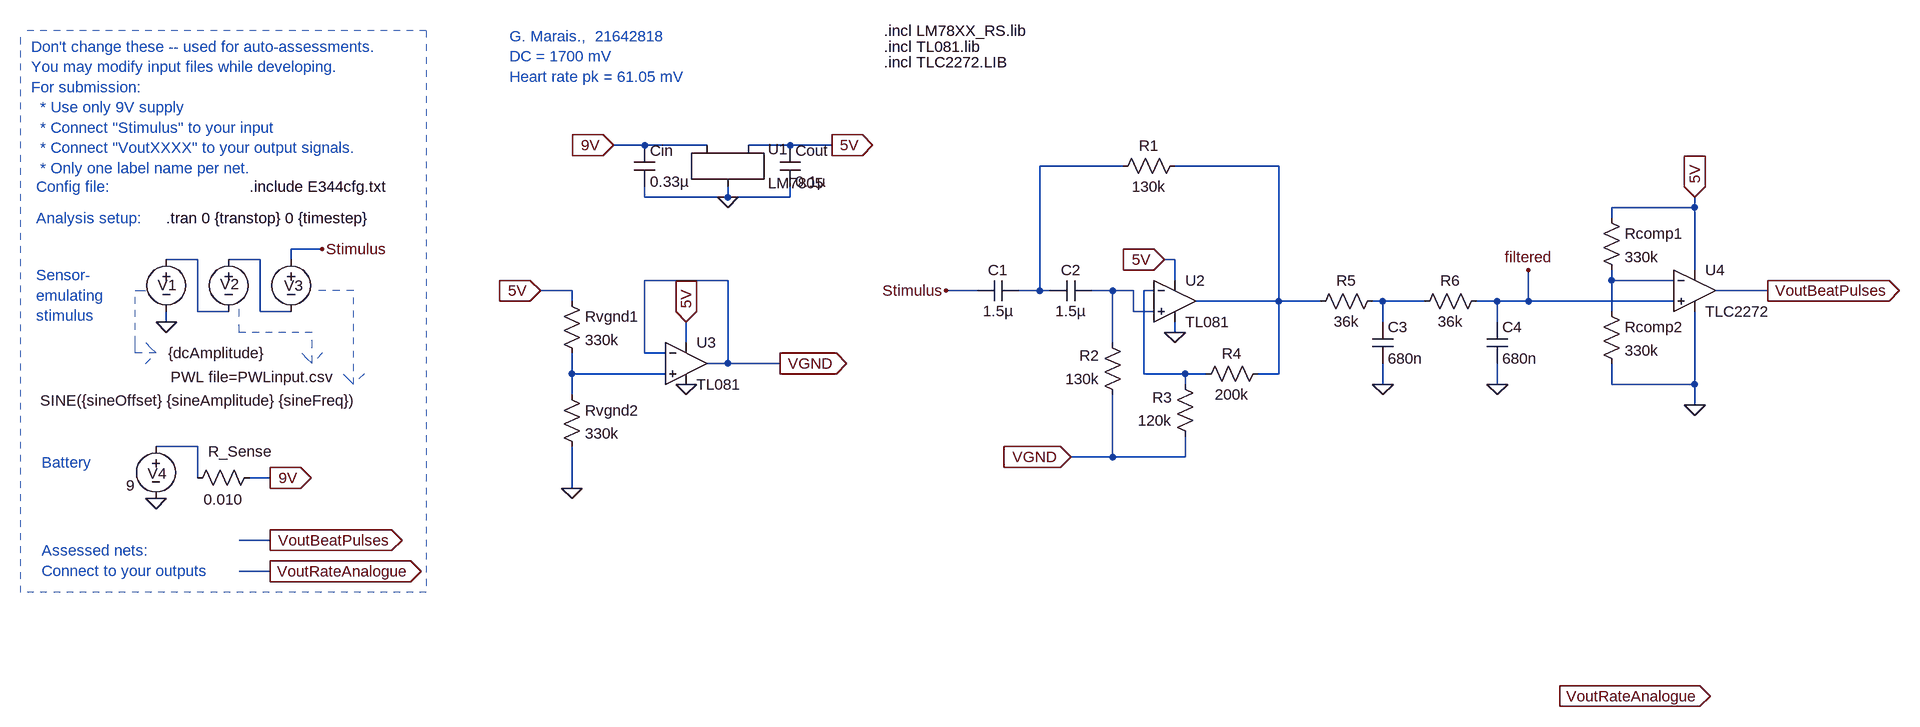
[diagram p0: schematic E344Ass2.asc]
E344Ass2.asc, the LTspice schematic file:
Version 4
SHEET 1 2080 680
WIRE -1344 -1232 -1392 -1232
WIRE -1248 -1232 -1344 -1232
WIRE -1120 -1232 -1184 -1232
WIRE -1056 -1232 -1120 -1232
WIRE -608 -1200 -736 -1200
WIRE -368 -1200 -528 -1200
WIRE -1344 -1152 -1344 -1168
WIRE -1216 -1152 -1216 -1168
WIRE -1216 -1152 -1344 -1152
WIRE -1120 -1152 -1120 -1168
WIRE -1120 -1152 -1216 -1152
WIRE 272 -1136 272 -1152
WIRE 272 -1136 144 -1136
WIRE 144 -1120 144 -1136
WIRE -1840 -1072 -1888 -1072
WIRE -2032 -1056 -2080 -1056
WIRE -1936 -1056 -1984 -1056
WIRE -1888 -1056 -1888 -1072
WIRE -528 -1056 -544 -1056
WIRE 272 -1040 272 -1136
WIRE -1216 -1024 -1344 -1024
WIRE -528 -1024 -528 -1056
WIRE 144 -1024 144 -1040
WIRE 240 -1024 144 -1024
WIRE -1456 -1008 -1504 -1008
WIRE -832 -1008 -880 -1008
WIRE -736 -1008 -736 -1200
WIRE -736 -1008 -768 -1008
WIRE -720 -1008 -736 -1008
WIRE -624 -1008 -656 -1008
WIRE -592 -1008 -624 -1008
WIRE -560 -1008 -576 -1008
WIRE 384 -1008 304 -1008
WIRE -1456 -992 -1456 -1008
WIRE -368 -992 -368 -1200
WIRE -368 -992 -496 -992
WIRE -304 -992 -368 -992
WIRE -208 -992 -224 -992
WIRE -144 -992 -208 -992
WIRE -32 -992 -64 -992
WIRE 16 -992 16 -1040
WIRE 16 -992 -32 -992
WIRE 240 -992 16 -992
WIRE -2032 -976 -2032 -1056
WIRE -1984 -976 -2032 -976
WIRE -1936 -976 -1936 -1056
WIRE -1888 -976 -1936 -976
WIRE -592 -976 -592 -1008
WIRE -560 -976 -592 -976
WIRE 144 -976 144 -1024
WIRE -2080 -960 -2080 -976
WIRE -208 -960 -208 -992
WIRE -32 -960 -32 -992
WIRE -528 -944 -528 -960
WIRE -1280 -928 -1280 -960
WIRE -624 -928 -624 -1008
WIRE -1344 -912 -1344 -1024
WIRE -1312 -912 -1344 -912
WIRE -1216 -896 -1216 -1024
WIRE -1216 -896 -1248 -896
WIRE -1136 -896 -1216 -896
WIRE -1456 -880 -1456 -912
WIRE -1312 -880 -1456 -880
WIRE -576 -880 -576 -1008
WIRE -512 -880 -576 -880
WIRE -480 -880 -512 -880
WIRE -368 -880 -368 -992
WIRE -368 -880 -400 -880
WIRE -512 -864 -512 -880
WIRE -208 -864 -208 -896
WIRE -32 -864 -32 -896
WIRE 144 -864 144 -896
WIRE 272 -864 272 -976
WIRE 272 -864 144 -864
WIRE -1456 -848 -1456 -880
WIRE 272 -832 272 -864
WIRE -2032 -768 -2096 -768
WIRE -624 -752 -624 -848
WIRE -624 -752 -688 -752
WIRE -512 -752 -512 -784
WIRE -512 -752 -624 -752
WIRE -2032 -720 -2032 -768
WIRE -1920 -720 -1952 -720
WIRE -1456 -704 -1456 -768
WIRE -1920 -624 -1968 -624
WIRE -1920 -576 -1968 -576
FLAG -2080 -960 0
FLAG -1840 -1072 Stimulus
FLAG -1920 -720 9V
IOPIN -1920 -720 Out
FLAG -2096 -688 0
FLAG -1392 -1232 9V
IOPIN -1392 -1232 In
FLAG -1920 -624 VoutBeatPulses
IOPIN -1920 -624 Out
FLAG -1920 -576 VoutRateAnalogue
IOPIN -1920 -576 Out
FLAG -1216 -1152 0
FLAG -1056 -1232 5V
IOPIN -1056 -1232 Out
FLAG -1136 -896 VGND
IOPIN -1136 -896 Out
FLAG -1456 -704 0
FLAG -1504 -1008 5V
IOPIN -1504 -1008 In
FLAG -528 -944 0
FLAG -544 -1056 5V
IOPIN -544 -1056 In
FLAG -688 -752 VGND
IOPIN -688 -752 In
FLAG -1280 -864 0
FLAG -1280 -960 5V
IOPIN -1280 -960 In
FLAG 272 -1152 5V
IOPIN 272 -1152 In
FLAG 272 -832 0
FLAG -32 -864 0
FLAG -208 -864 0
FLAG 384 -1008 VoutBeatPulses
IOPIN 384 -1008 Out
FLAG -880 -1008 Stimulus
FLAG 64 -384 VoutRateAnalogue
IOPIN 64 -384 Out
FLAG 16 -1040 filtered
SYMBOL voltage -1984 -1072 R0
WINDOW 123 0 0 Left 0
WINDOW 39 0 0 Left 0
WINDOW 3 -89 197 Left 2
WINDOW 0 -13 54 Left 2
SYMATTR Value PWL file=PWLinput.csv
SYMATTR InstName V2
SYMBOL voltage -1888 -1072 R0
WINDOW 123 24 44 Left 2
WINDOW 39 0 0 Left 0
WINDOW 3 -386 233 Left 2
WINDOW 0 -11 56 Left 2
SYMATTR Value SINE({sineOffset} {sineAmplitude} {sineFreq})
SYMATTR InstName V3
SYMBOL voltage -2080 -1072 R0
WINDOW 123 0 0 Left 0
WINDOW 39 0 0 Left 0
WINDOW 3 3 160 Left 2
WINDOW 0 -13 55 Left 2
SYMATTR Value {dcAmplitude}
SYMATTR InstName V1
SYMBOL voltage -2096 -784 R0
WINDOW 123 24 44 Left 2
WINDOW 39 0 0 Left 0
WINDOW 3 -46 76 Left 2
WINDOW 0 -13 57 Left 2
SYMATTR Value 9
SYMATTR InstName V4
SYMBOL res -1936 -736 R90
WINDOW 0 -9 30 VBottom 2
WINDOW 3 34 56 VTop 2
SYMATTR InstName R_Sense
SYMATTR Value 0.010
SYMBOL LM7805 -1216 -1216 R0
SYMATTR InstName U1
SYMBOL cap -1360 -1232 R0
SYMATTR InstName Cin
SYMATTR Value 0.33µ
SYMBOL cap -1136 -1232 R0
SYMATTR InstName Cout
SYMATTR Value 0.1µ
SYMBOL res -1472 -1008 R0
SYMATTR InstName Rvgnd1
SYMATTR Value 330k
SYMBOL res -1472 -864 R0
SYMATTR InstName Rvgnd2
SYMATTR Value 330k
SYMBOL cap -768 -1024 R90
WINDOW 0 0 32 VBottom 2
WINDOW 3 32 32 VTop 2
SYMATTR InstName C1
SYMATTR Value 1.5µ
SYMBOL cap -656 -1024 R90
WINDOW 0 0 32 VBottom 2
WINDOW 3 32 32 VTop 2
SYMATTR InstName C2
SYMATTR Value 1.5µ
SYMBOL res -512 -1216 R90
WINDOW 0 0 56 VBottom 2
WINDOW 3 32 56 VTop 2
SYMATTR InstName R1
SYMATTR Value 130k
SYMBOL res -608 -832 R180
WINDOW 0 36 76 Left 2
WINDOW 3 36 40 Left 2
SYMATTR InstName R2
SYMATTR Value 130k
SYMBOL res -496 -768 R180
WINDOW 0 36 76 Left 2
WINDOW 3 36 40 Left 2
SYMATTR InstName R3
SYMATTR Value 120k
SYMBOL res -384 -896 R90
WINDOW 0 0 56 VBottom 2
WINDOW 3 32 56 VTop 2
SYMATTR InstName R4
SYMATTR Value 200k
SYMBOL Opamps\\opamp2 -528 -1056 R0
SYMATTR InstName U2
SYMATTR Value TL081
SYMBOL Opamps\\opamp2 -1280 -960 R0
SYMATTR InstName U3
SYMATTR Value TL081
SYMBOL res -208 -1008 R90
WINDOW 0 0 56 VBottom 2
WINDOW 3 32 56 VTop 2
SYMATTR InstName R5
SYMATTR Value 36k
SYMBOL cap -224 -960 R0
SYMATTR InstName C3
SYMATTR Value 680n
SYMBOL Opamps\\opamp2 272 -1072 R0
SYMATTR InstName U4
SYMATTR Value TLC2272
SYMBOL cap -48 -960 R0
SYMATTR InstName C4
SYMATTR Value 680n
SYMBOL res -48 -1008 R90
WINDOW 0 0 56 VBottom 2
WINDOW 3 32 56 VTop 2
SYMATTR InstName R6
SYMATTR Value 36k
SYMBOL res 128 -1136 R0
SYMATTR InstName Rcomp1
SYMATTR Value 330k
SYMBOL res 128 -992 R0
SYMATTR InstName Rcomp2
SYMATTR Value 330k
TEXT -2080 -1120 Left 2 !.tran 0 {transtop} 0 {timestep}
TEXT -1952 -1168 Left 2 !.include E344cfg.txt
TEXT -2288 -1384 Left 2 ;Don't change these -- used for auto-assessments.\nYou may modify input files while developing.\nFor submission: \n  * Use only 9V supply \n  * Connect "Stimulus" to your input\n  * Connect "VoutXXXX" to your output signals.\n  * Only one label name per net.
TEXT -2280 -1168 Left 2 ;Config file:
TEXT -2280 -1120 Left 2 ;Analysis setup:
TEXT -2272 -744 Left 2 ;Battery
TEXT -2280 -1032 Left 2 ;Sensor-\nemulating \nstimulus
TEXT -2272 -608 Left 2 ;Assessed nets:\nConnect to your outputs
TEXT -1552 -1400 Left 2 ;G. Marais.,  21642818\nDC = 1700 mV\nHeart rate pk = 61.05 mV
TEXT -976 -1408 Left 2 !.incl LM78XX_RS.lib
TEXT -976 -1384 Left 2 !.incl TL081.lib
TEXT -976 -1360 Left 2 !.incl TLC2272.LIB
LINE Normal -1792 -1008 -1856 -1008 2
LINE Normal -1792 -864 -1792 -1008 2
LINE Normal -1808 -880 -1792 -864 2
LINE Normal -1792 -864 -1808 -880 2
LINE Normal -1776 -880 -1792 -864 2
LINE Normal -2128 -1008 -2112 -1008 2
LINE Normal -2128 -928 -2128 -1008 2
LINE Normal -2128 -912 -2128 -928 2
LINE Normal -2096 -912 -2128 -912 2
LINE Normal -2112 -928 -2096 -912 2
LINE Normal -2096 -912 -2112 -928 2
LINE Normal -2112 -896 -2096 -912 2
LINE Normal -1968 -944 -1968 -992 2
LINE Normal -1856 -944 -1968 -944 2
LINE Normal -1856 -896 -1856 -944 2
LINE Normal -1872 -912 -1856 -896 2
LINE Normal -1856 -896 -1872 -912 2
LINE Normal -1840 -912 -1856 -896 2
LINE Normal -2304 -544 -2304 -1408 1
LINE Normal -1680 -1408 -1680 -544 1
LINE Normal -1680 -544 -2304 -544 1
LINE Normal -1680 -1408 -2304 -1408 1

The netlist it stands for:
* E344Ass2.asc
V2 N004 N003 PWL file=PWLinput.csv
V3 Stimulus N004 SINE({sineOffset} {sineAmplitude} {sineFreq})
V1 N003 0 {dcAmplitude}
V4 N010 0 9
R_Sense 9V N010 0.010
XU1 9V 0 5V LM7805
Cin 9V 0 0.33µ
Cout 5V 0 0.1µ
Rvgnd1 5V N009 330k
Rvgnd2 N009 0 330k
C1 N001 Stimulus 1.5µ
C2 N006 N001 1.5µ
R1 N002 N001 130k
R2 VGND N006 130k
R3 VGND N007 120k
R4 N002 N007 200k
XU2 N006 N007 5V 0 N002 TL081  ; pins In+ In- V+ V- OUT
XU3 N009 VGND 5V 0 VGND TL081  ; pins In+ In- V+ V- OUT
R5 N008 N002 36k
C3 N008 0 680n
XU4 filtered N005 5V 0 VoutBeatPulses TLC2272  ; pins In+ In- V+ V- OUT
C4 filtered 0 680n
R6 filtered N008 36k
Rcomp1 5V N005 330k
Rcomp2 N005 0 330k
.tran 0 {transtop} 0 {timestep}
.include E344cfg.txt
* Don't change these -- used for auto-assessments.
* You may modify input files while developing.
* For submission:
*   * Use only 9V supply
*   * Connect "Stimulus" to your input
*   * Connect "VoutXXXX" to your output signals.
*   * Only one label name per net.
* Config file:
* Analysis setup:
* Battery
* Sensor-
* emulating
* stimulus
* Assessed nets:
* Connect to your outputs
* G. Marais.,  21642818
* DC = 1700 mV
* Heart rate pk = 61.05 mV
.incl LM78XX_RS.lib
.incl TL081.lib
.incl TLC2272.LIB
.backanno
.end